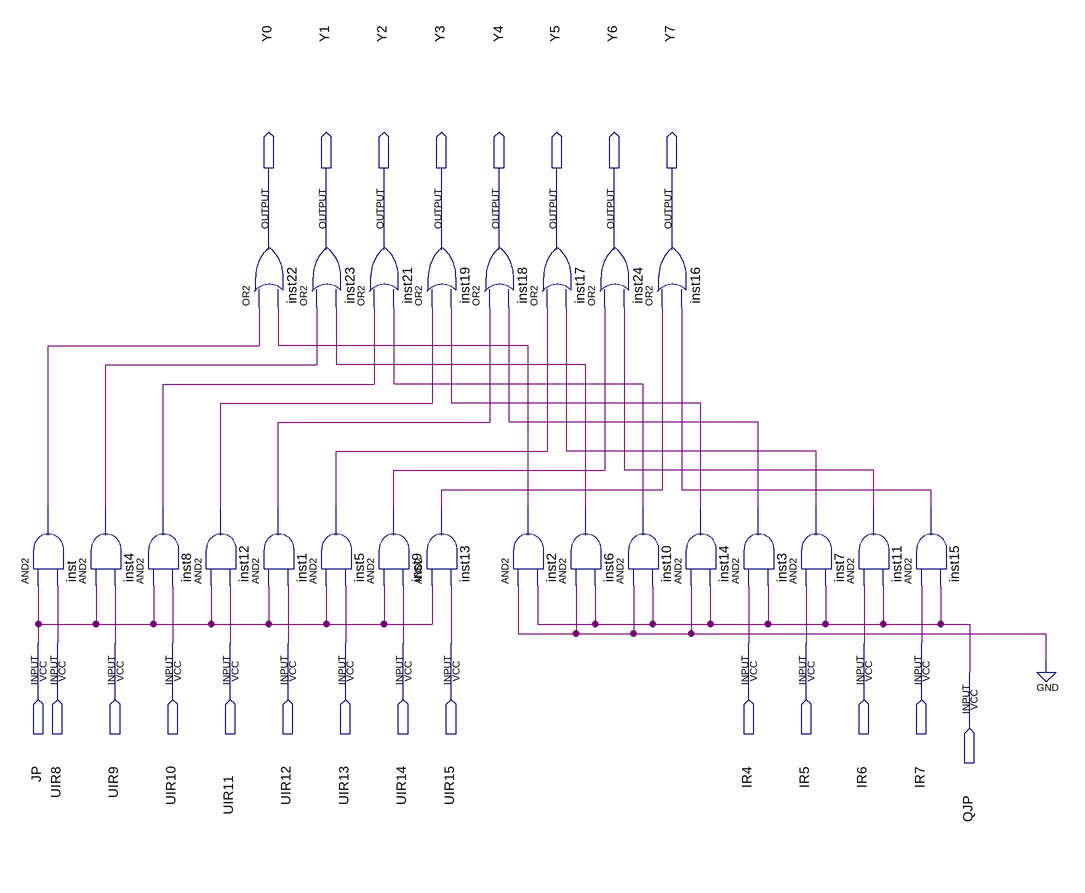
[diagram p0: schematic sheet]
// Quartus schematic houjidizhi.bdf as structural Verilog: 24 symbols, 22 pins
module houjidizhi (
  input  JP,
  input  UIR8,
  input  UIR9,
  input  UIR10,
  input  UIR11,
  input  UIR12,
  input  UIR13,
  input  UIR14,
  input  UIR15,
  input  IR4,
  input  IR5,
  input  IR6,
  input  IR7,
  input  QJP,
  output Y0,
  output Y1,
  output Y2,
  output Y3,
  output Y4,
  output Y5,
  output Y6,
  output Y7
);

  wire inst1_out, inst2_out, inst3_out, inst4_out, inst5_out, inst6_out, inst7_out, inst8_out, inst9_out,
       inst10_out, inst11_out, inst12_out, inst13_out, inst14_out, inst15_out, inst_out;

  and inst (inst_out, JP, UIR8);
  and inst4 (inst4_out, JP, UIR9);
  and inst8 (inst8_out, JP, UIR10);
  or inst22 (Y0, inst_out, inst2_out);
  and inst12 (inst12_out, JP, UIR11);
  or inst23 (Y1, inst4_out, inst6_out);
  and inst1 (inst1_out, JP, UIR12);
  and inst5 (inst5_out, JP, UIR13);
  or inst21 (Y2, inst8_out, inst10_out);
  and inst9 (inst9_out, JP, UIR14);
  or inst18 (Y4, inst1_out, inst3_out);
  or inst19 (Y3, inst12_out, inst14_out);
  and inst13 (inst13_out, JP, UIR15);
  or inst17 (Y5, inst5_out, inst7_out);
  and inst2 (inst2_out, 1'b0, QJP);
  or inst24 (Y6, inst9_out, inst11_out);
  and inst6 (inst6_out, 1'b0, QJP);
  and inst10 (inst10_out, 1'b0, QJP);
  or inst16 (Y7, inst13_out, inst15_out);
  and inst14 (inst14_out, 1'b0, QJP);
  and inst3 (inst3_out, IR4, QJP);
  and inst7 (inst7_out, IR5, QJP);
  and inst11 (inst11_out, IR6, QJP);
  and inst15 (inst15_out, IR7, QJP);
endmodule
